# Altium project ist_pit.PrjPCB
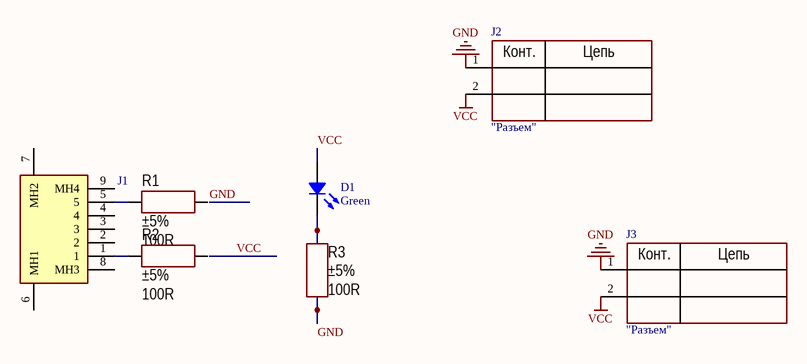
[diagram p0: ist_pit.SchDoc]
1 sheet, 7 parts. Net scope: global (net labels, ports and power ports of the same name join across sheets).
Board file: ist_pit.PcbDoc

## Sheet ist_pit.SchDoc
size A4

### Parts
D1  Green  [LED 0603_1608 GREEN]
J1  C10418  [C10418]  (value not drawn)
J2  "Разъем"  [CON: PBS-2]
J3  "Разъем"  [CON: PBS-2]
R1  value 100R  Tolerance: ±5%  [RES: 0603]
R2  value 100R  Tolerance: ±5%  [RES: 0603]
R3  value 100R  Tolerance: ±5%  [RES: 0603]

### Nets
GND: J2.1 J3.1 R3.1
VCC: D1.1 J2.2 J3.2
NetD1_2: D1.2 R3.2
NetJ1_1: J1.1 R2.1
NetJ1_5: J1.5 R1.1

Not connected (* = marked no-connect by the designer): J1 2 3 4 6(MH1) 7(MH2) 8(MH3) 9(MH4); R1 2; R2 2

### Notes on the sheet
- (in symbol PBS-2-2) Конт.; Цепь

### Library data of the parts
D1 = LSM0603453V: LED SM 0603 3V -/1000/-MCD GREEN; Manufacturer: Visual Communications Company - VCC; Configuration: Standard; Current - Test: 20mA; Lens Color: Colorless; Lens Size: 1.20mm x 0.80mm; Lens Style: Rectangle with Flat Top; Lens Transparency: Clear; Millicandela Rating: 63mcd; Viewing Angle: 120°; Voltage - Forward (Vf) (Typ): 2V; Wavelength - Dominant: 572nm; Wavelength - Peak: 571nm; Part Number: LSM0603453V; Color: Green; ComponentLink1Description: Datasheet; ComponentLink1URL: https://vcclite.com/wp-content/uploads/wpallimport/files/files/LSM0603453V.pdf; ComponentLink2Description: DigiKey Link; ComponentLink2URL: http://digikey.com/product-detail/en/visual-communications-company-vcc/LSM0603453V/LSM0603453VCT-ND/9486729; Device Package: 0603 (1608 Metric); Height (Max): 0.65mm; LastUpdated: 21.01.2020 3:12:15; Lifecycle Status: Active; Minimum Order: 1; Mounting Type: Surface Mount; Package / Case: 0603 (1608 Metric); Packaging: TapeAndReel; PartId: 579; Part Status: Active; Price: 0.06; Series: LSM0603; Size / Dimension: 1.60mm L x 0.80mm W; Supplier 1: DigiKey; Supplier Part Number 1: LSM0603453VCT-ND; Supplier Device Package: Chip LED; Value: Green
J1 = C10418: Connector; Manufacturer_Name: Jing Extension of the Electronic Co.; Datasheet Link: https://datasheet.lcsc.com/szlcsc/Jing-Extension-of-the-Electronic-Co-LCSC-MICRO-USB-5S-B-Type-horns-High-temperature_C10418.pdf; Height: 3mm; Manufacturer_Part_Number: C10418
J2 J3 = PBS-2-2
R1-R3 = Resistor_0603: Manufacturer: Yageo; PartNumber: RC0603JR-07100RL; ValueManufacturerPartNumber: Resistor film, 100R, ±5%, 0603, 0.1W, -55...+125°C; TypeResistor: Resistor film; Power: 0.1W; Package: 0603; HelpURL: https://www.digikey.com/product-detail/en/yageo/RC0603JR-07100RL/311-100GRCT-ND/729644; Temperature: -55...+125°C